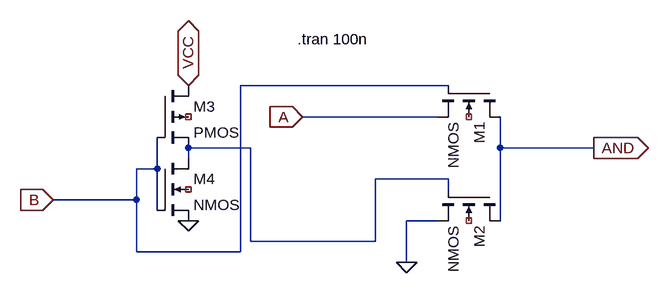
[diagram p0: schematic ANDpass.asc]
ANDpass.asc, the LTspice schematic file:
Version 4
SHEET 1 880 680
WIRE 480 48 160 48
WIRE 464 96 256 96
WIRE 176 144 80 144
WIRE 560 144 560 96
WIRE 704 144 560 144
WIRE 80 160 80 144
WIRE 32 176 32 128
WIRE 32 176 0 176
WIRE 480 192 368 192
WIRE 480 208 480 192
WIRE 0 224 0 176
WIRE 0 224 -128 224
WIRE 32 240 32 176
WIRE 464 256 416 256
WIRE 560 256 560 144
WIRE 176 288 176 144
WIRE 368 288 368 192
WIRE 368 288 176 288
WIRE 0 304 0 224
WIRE 160 304 160 48
WIRE 160 304 0 304
WIRE 416 320 416 256
FLAG 416 320 0
FLAG 704 144 AND
IOPIN 704 144 Out
FLAG 256 96 A
IOPIN 256 96 In
FLAG -128 224 B
IOPIN -128 224 In
FLAG 80 256 0
FLAG 80 48 VCC
IOPIN 80 48 BiDir
SYMBOL nmos4 560 48 R90
SYMATTR InstName M1
SYMBOL nmos4 560 208 R90
SYMATTR InstName M2
SYMBOL pmos4 32 48 R0
SYMATTR InstName M3
SYMBOL nmos4 32 160 R0
SYMATTR InstName M4
TEXT 248 -24 Left 2 !.tran 100n

The netlist it stands for:
* ANDpass.asc
M1 AND B A NC_01 NMOS
M2 AND N001 0 NC_02 NMOS
M3 VCC B N001 NC_03 PMOS
M4 N001 B 0 NC_04 NMOS
.model NMOS NMOS
.model PMOS PMOS
.lib standard.mos
.tran 100n
.backanno
.end